# EasyEDA schematic CruiseControlSystemElectricalSchematic_11_28_19_EasyEDA.json

## Sheets
1 Sheet_1: TITLE: Cruise Control System Wiring Diagram; REV: 1.0; Date: 2019-10-14; Sheet: 1/1; Drawn By: tzmetz; Company: Mechmotum Lab
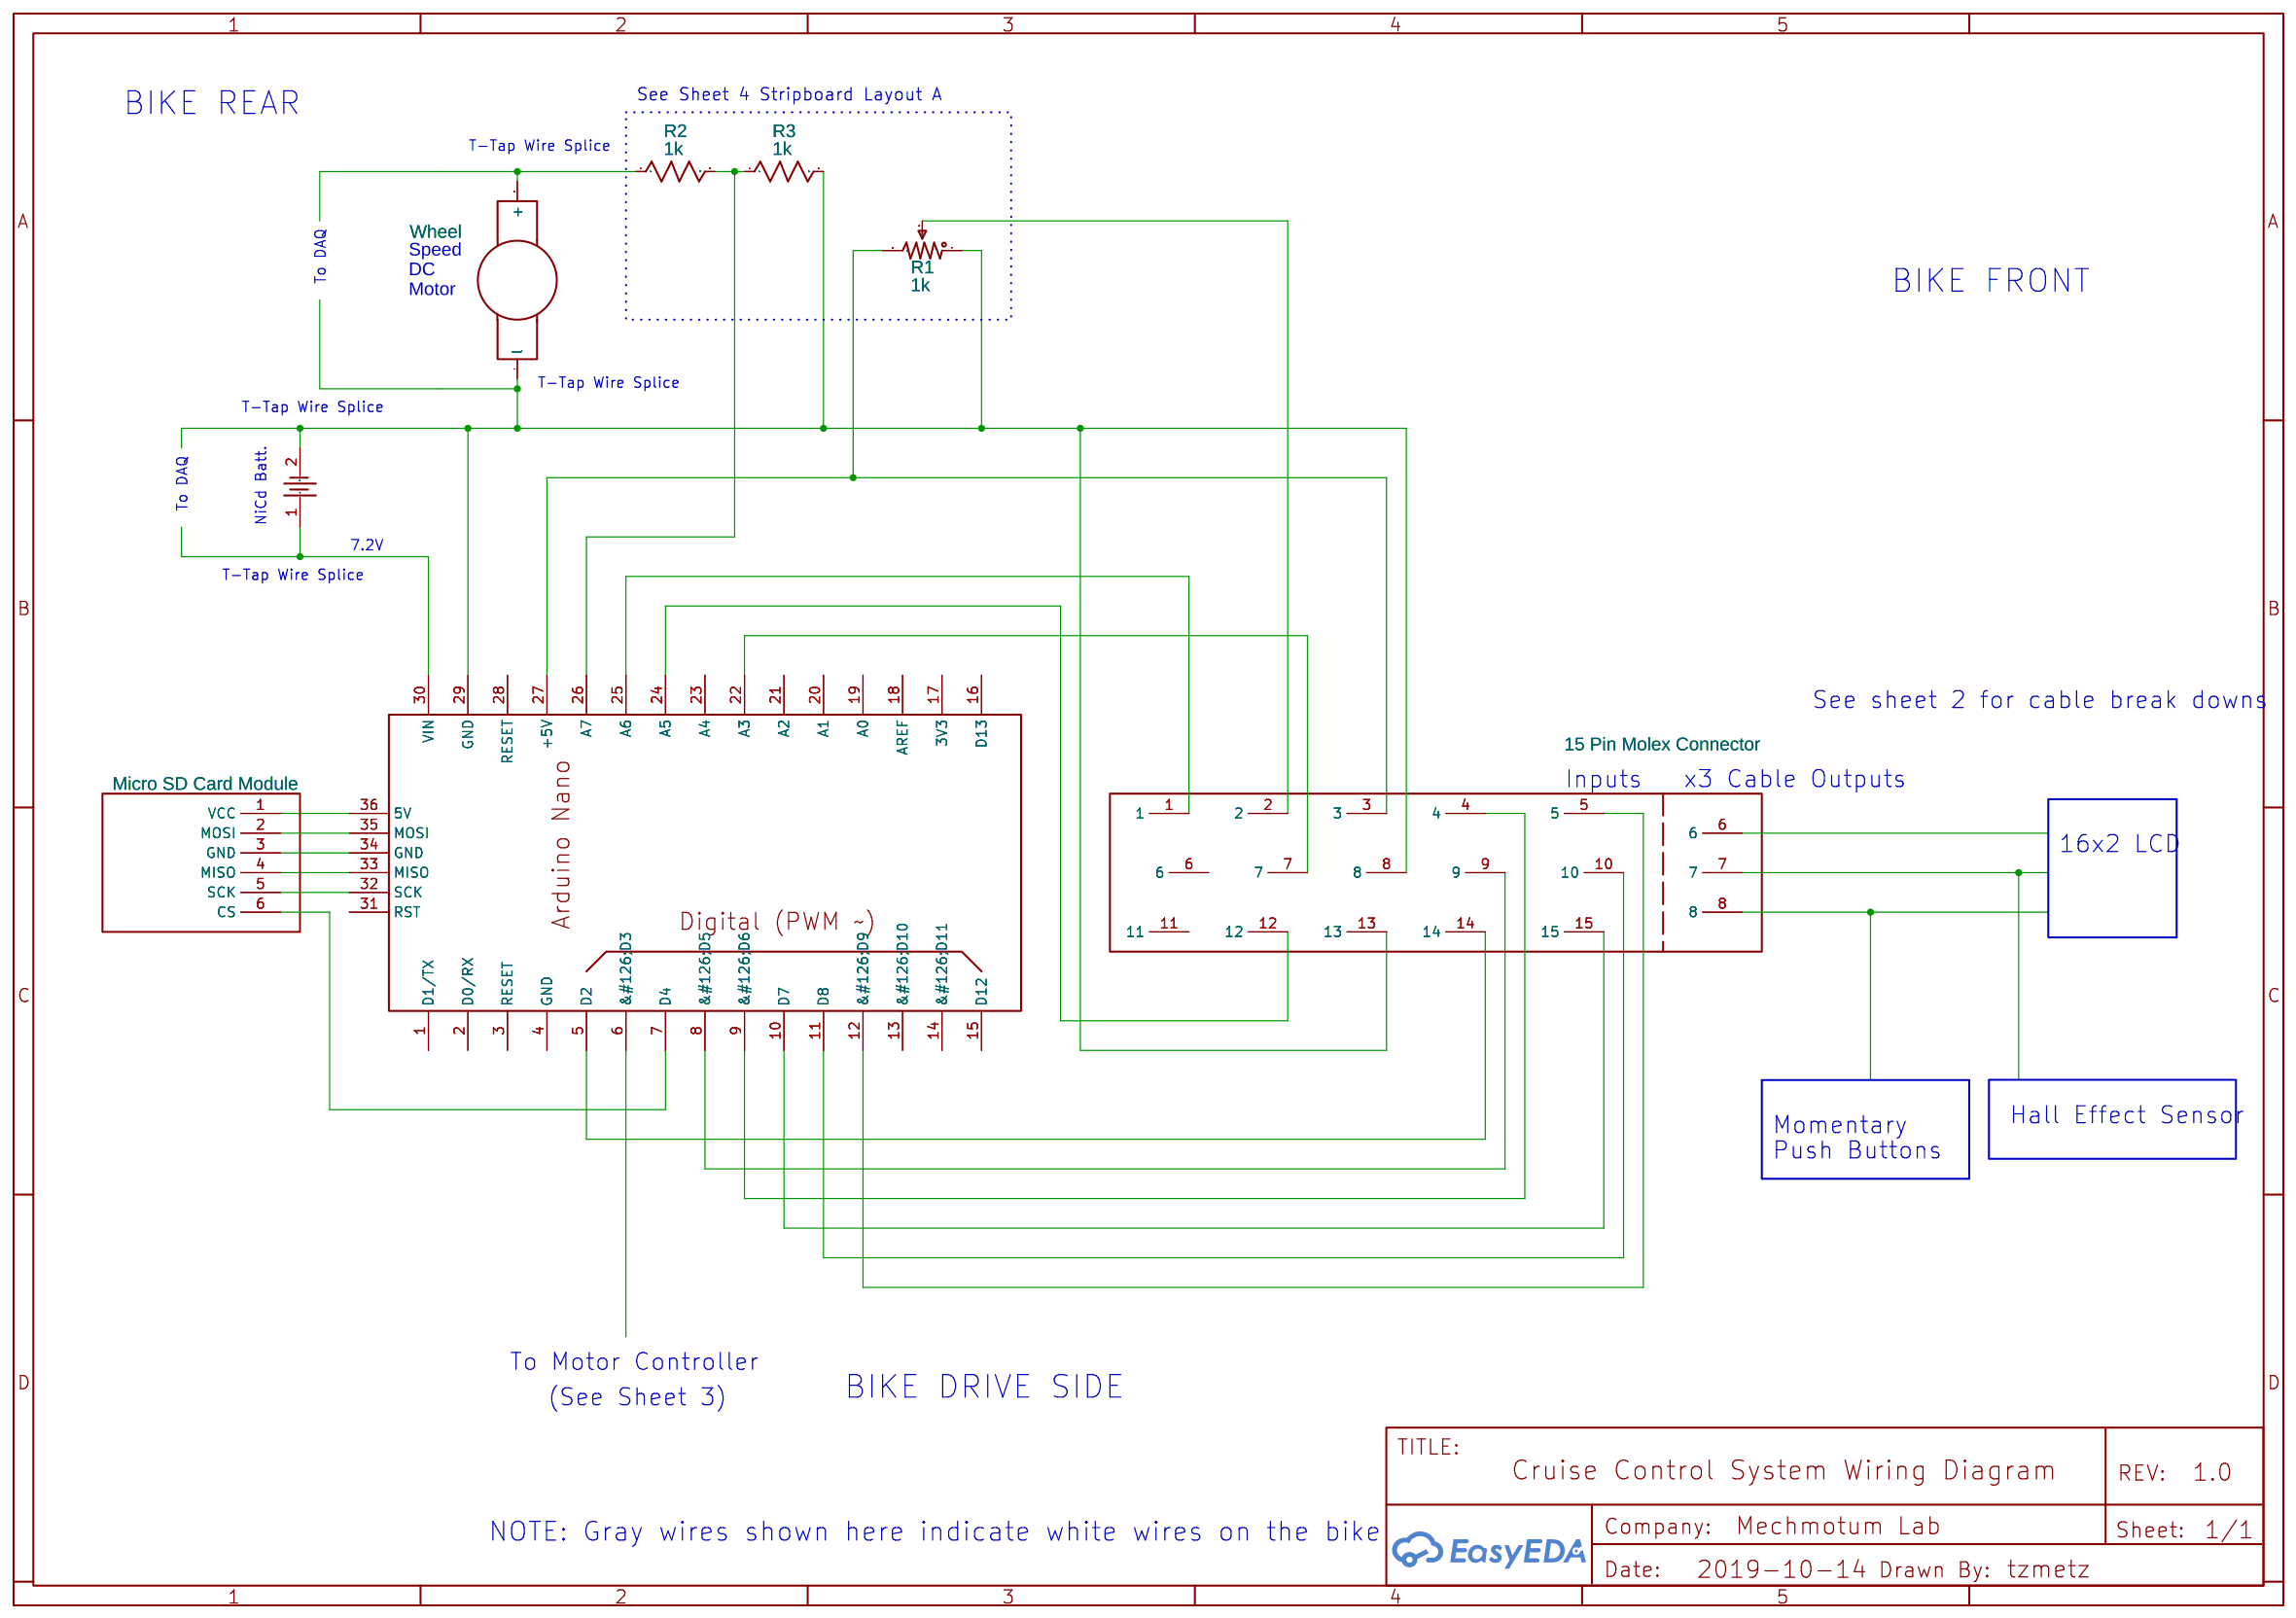
[diagram p0: Sheet_1]
2 Sheet_2: TITLE: Molex Connector Output Details; Date: 2019-10-16
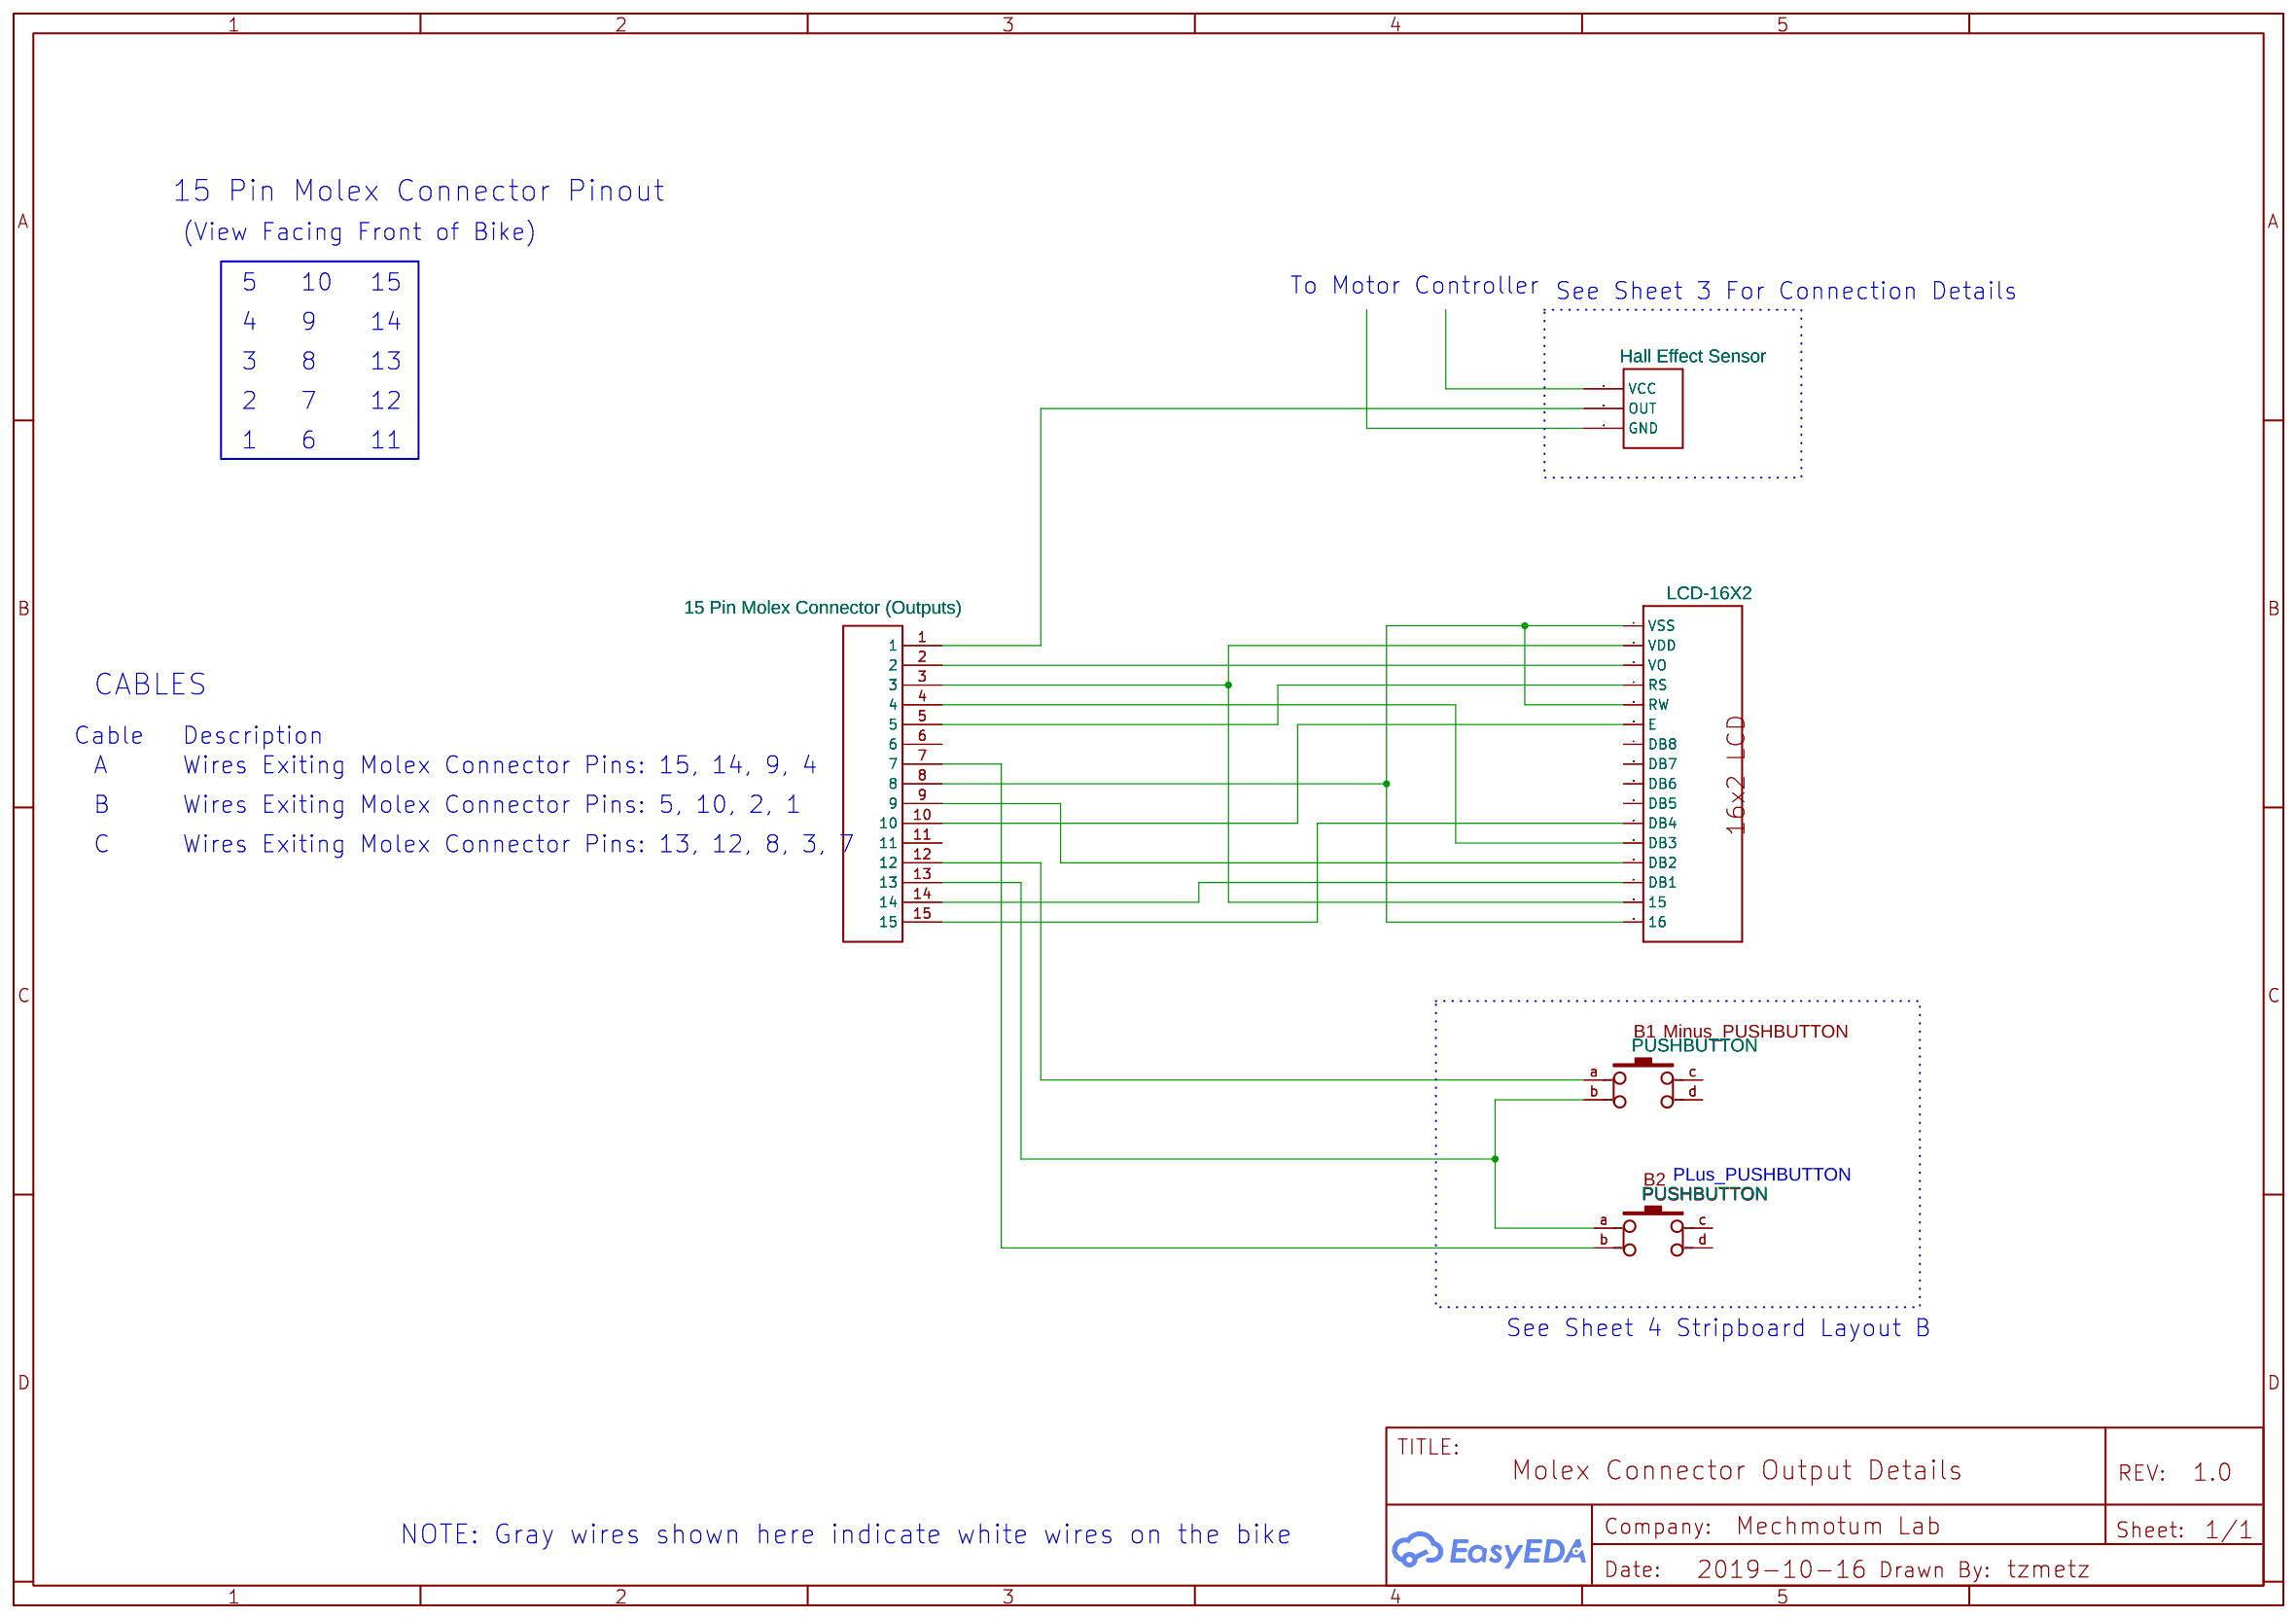
[diagram p1: Sheet_2]
3 Sheet_3: TITLE: Throttle Connection Diagram; Date: 2019-10-25
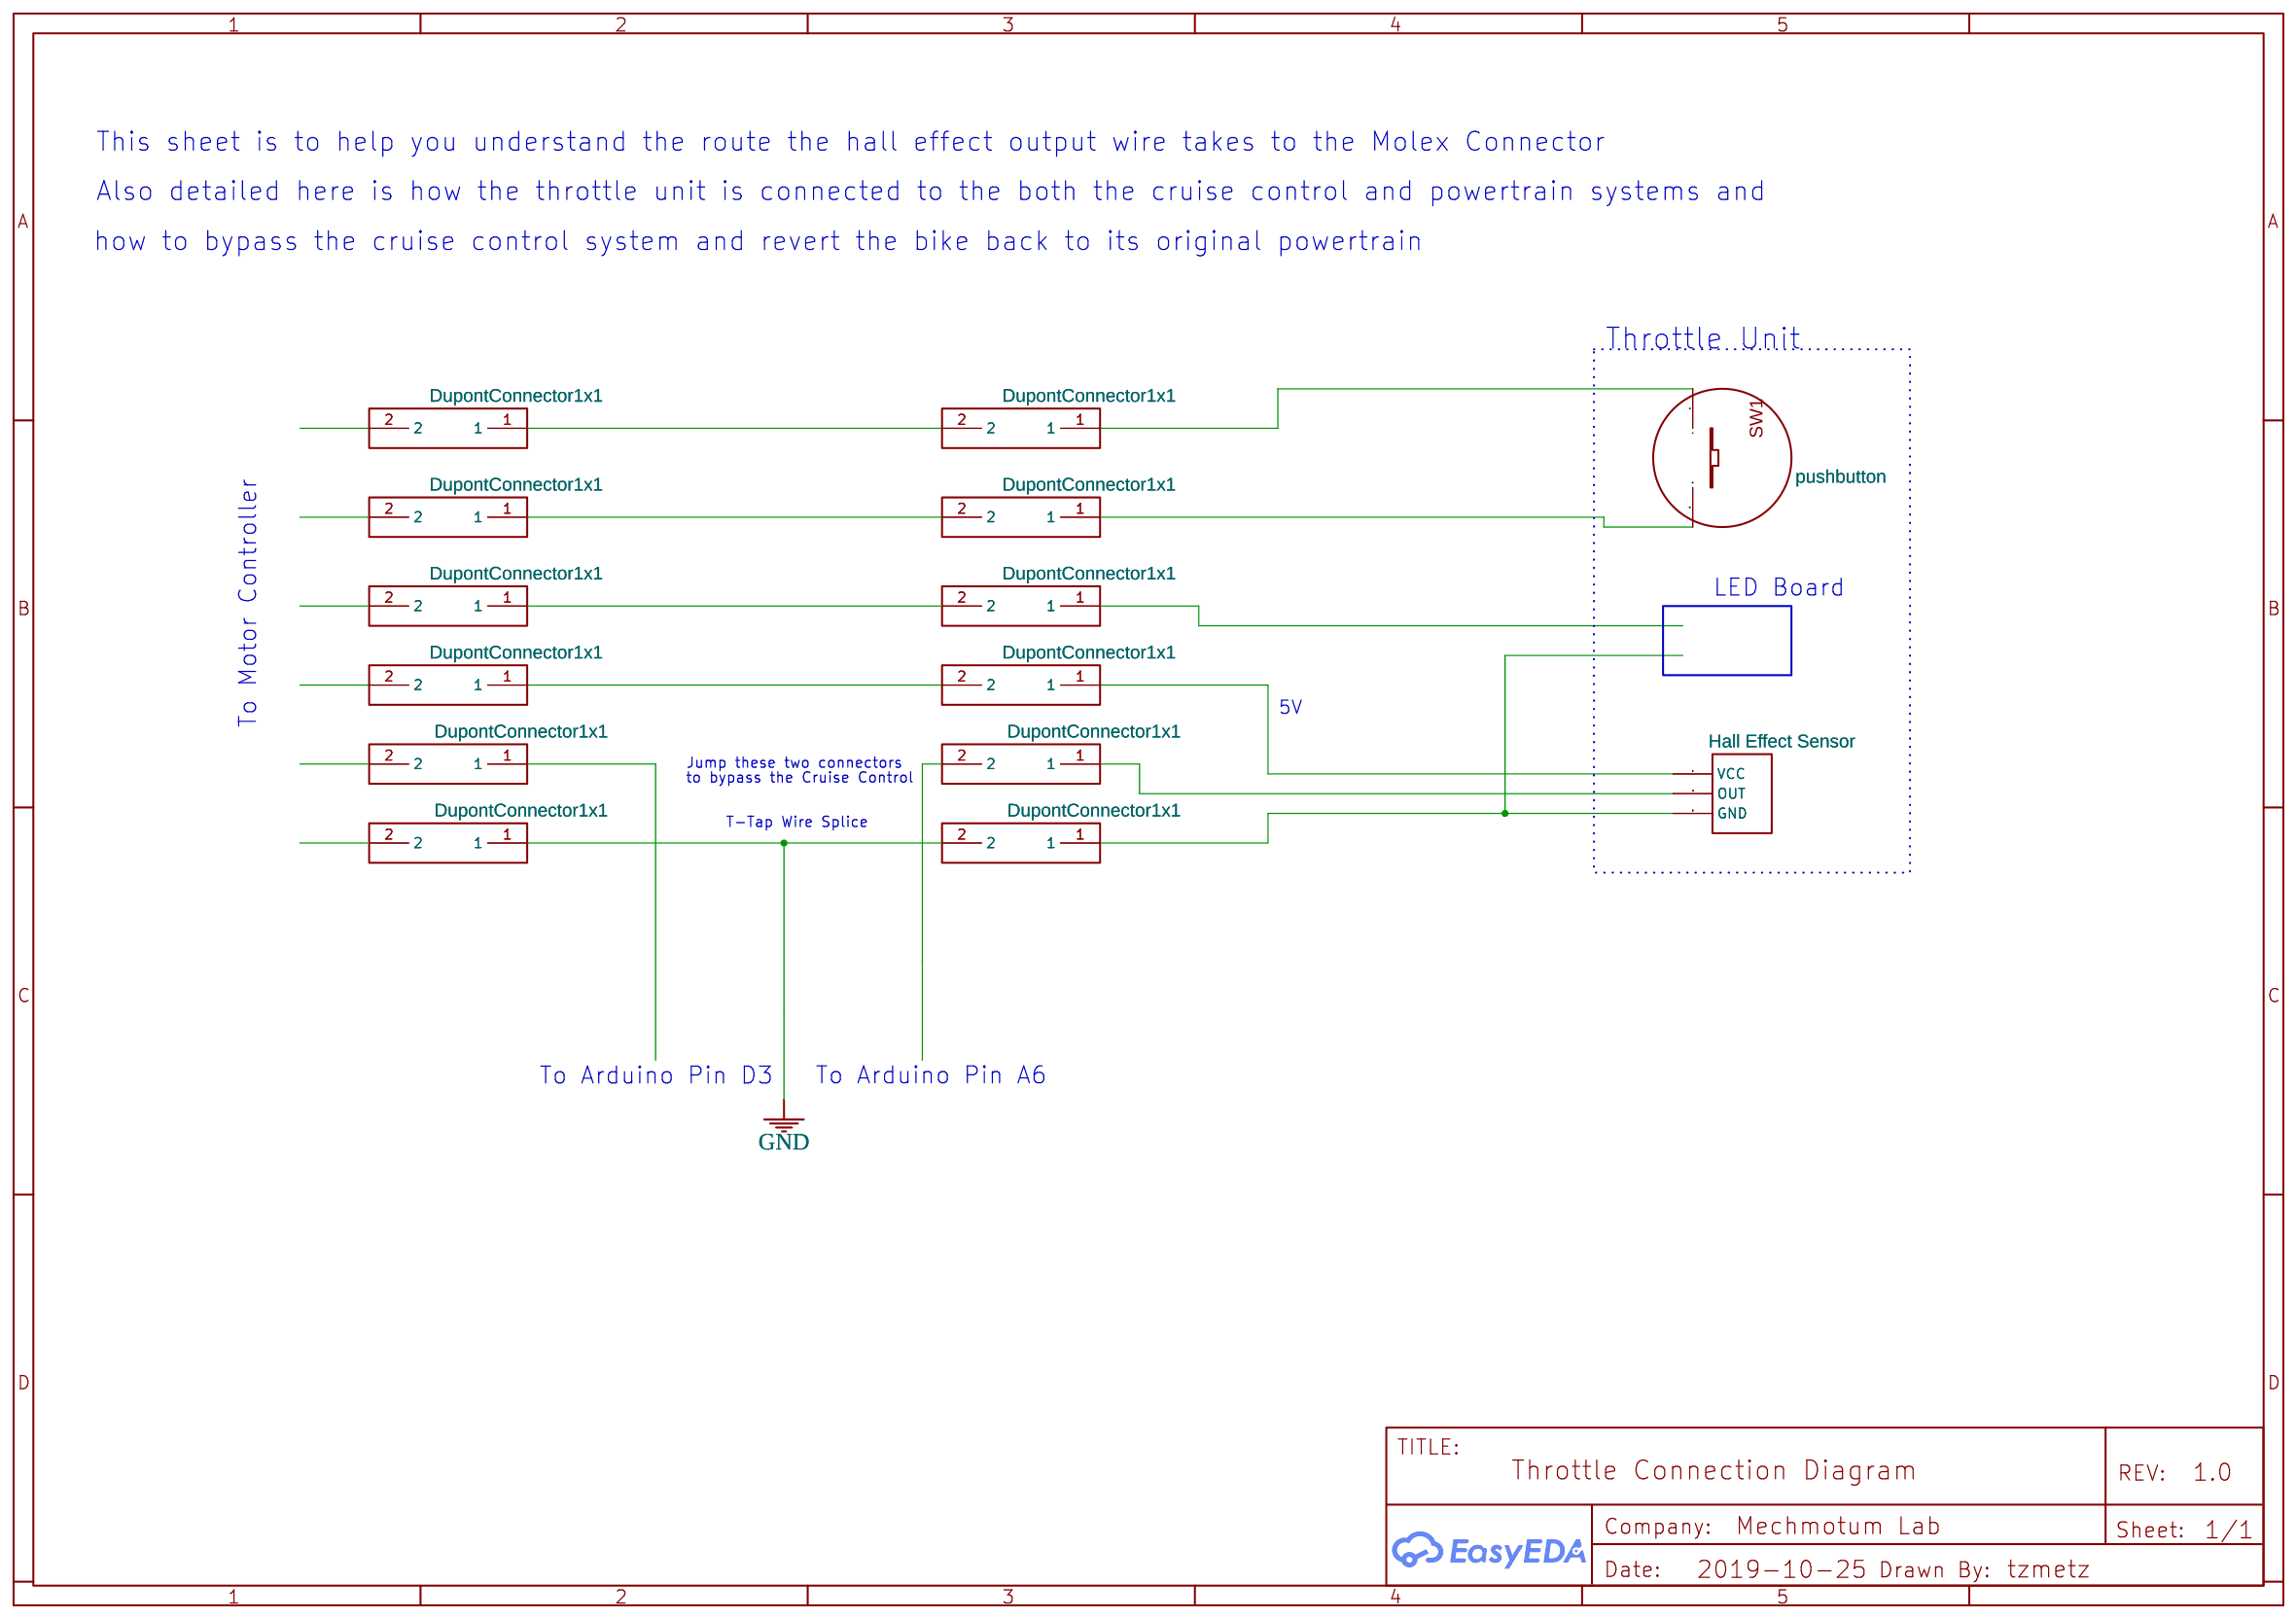
[diagram p2: Sheet_3]
4 Sheet_4: TITLE: Stripboard Layouts; Date: 2019-10-28
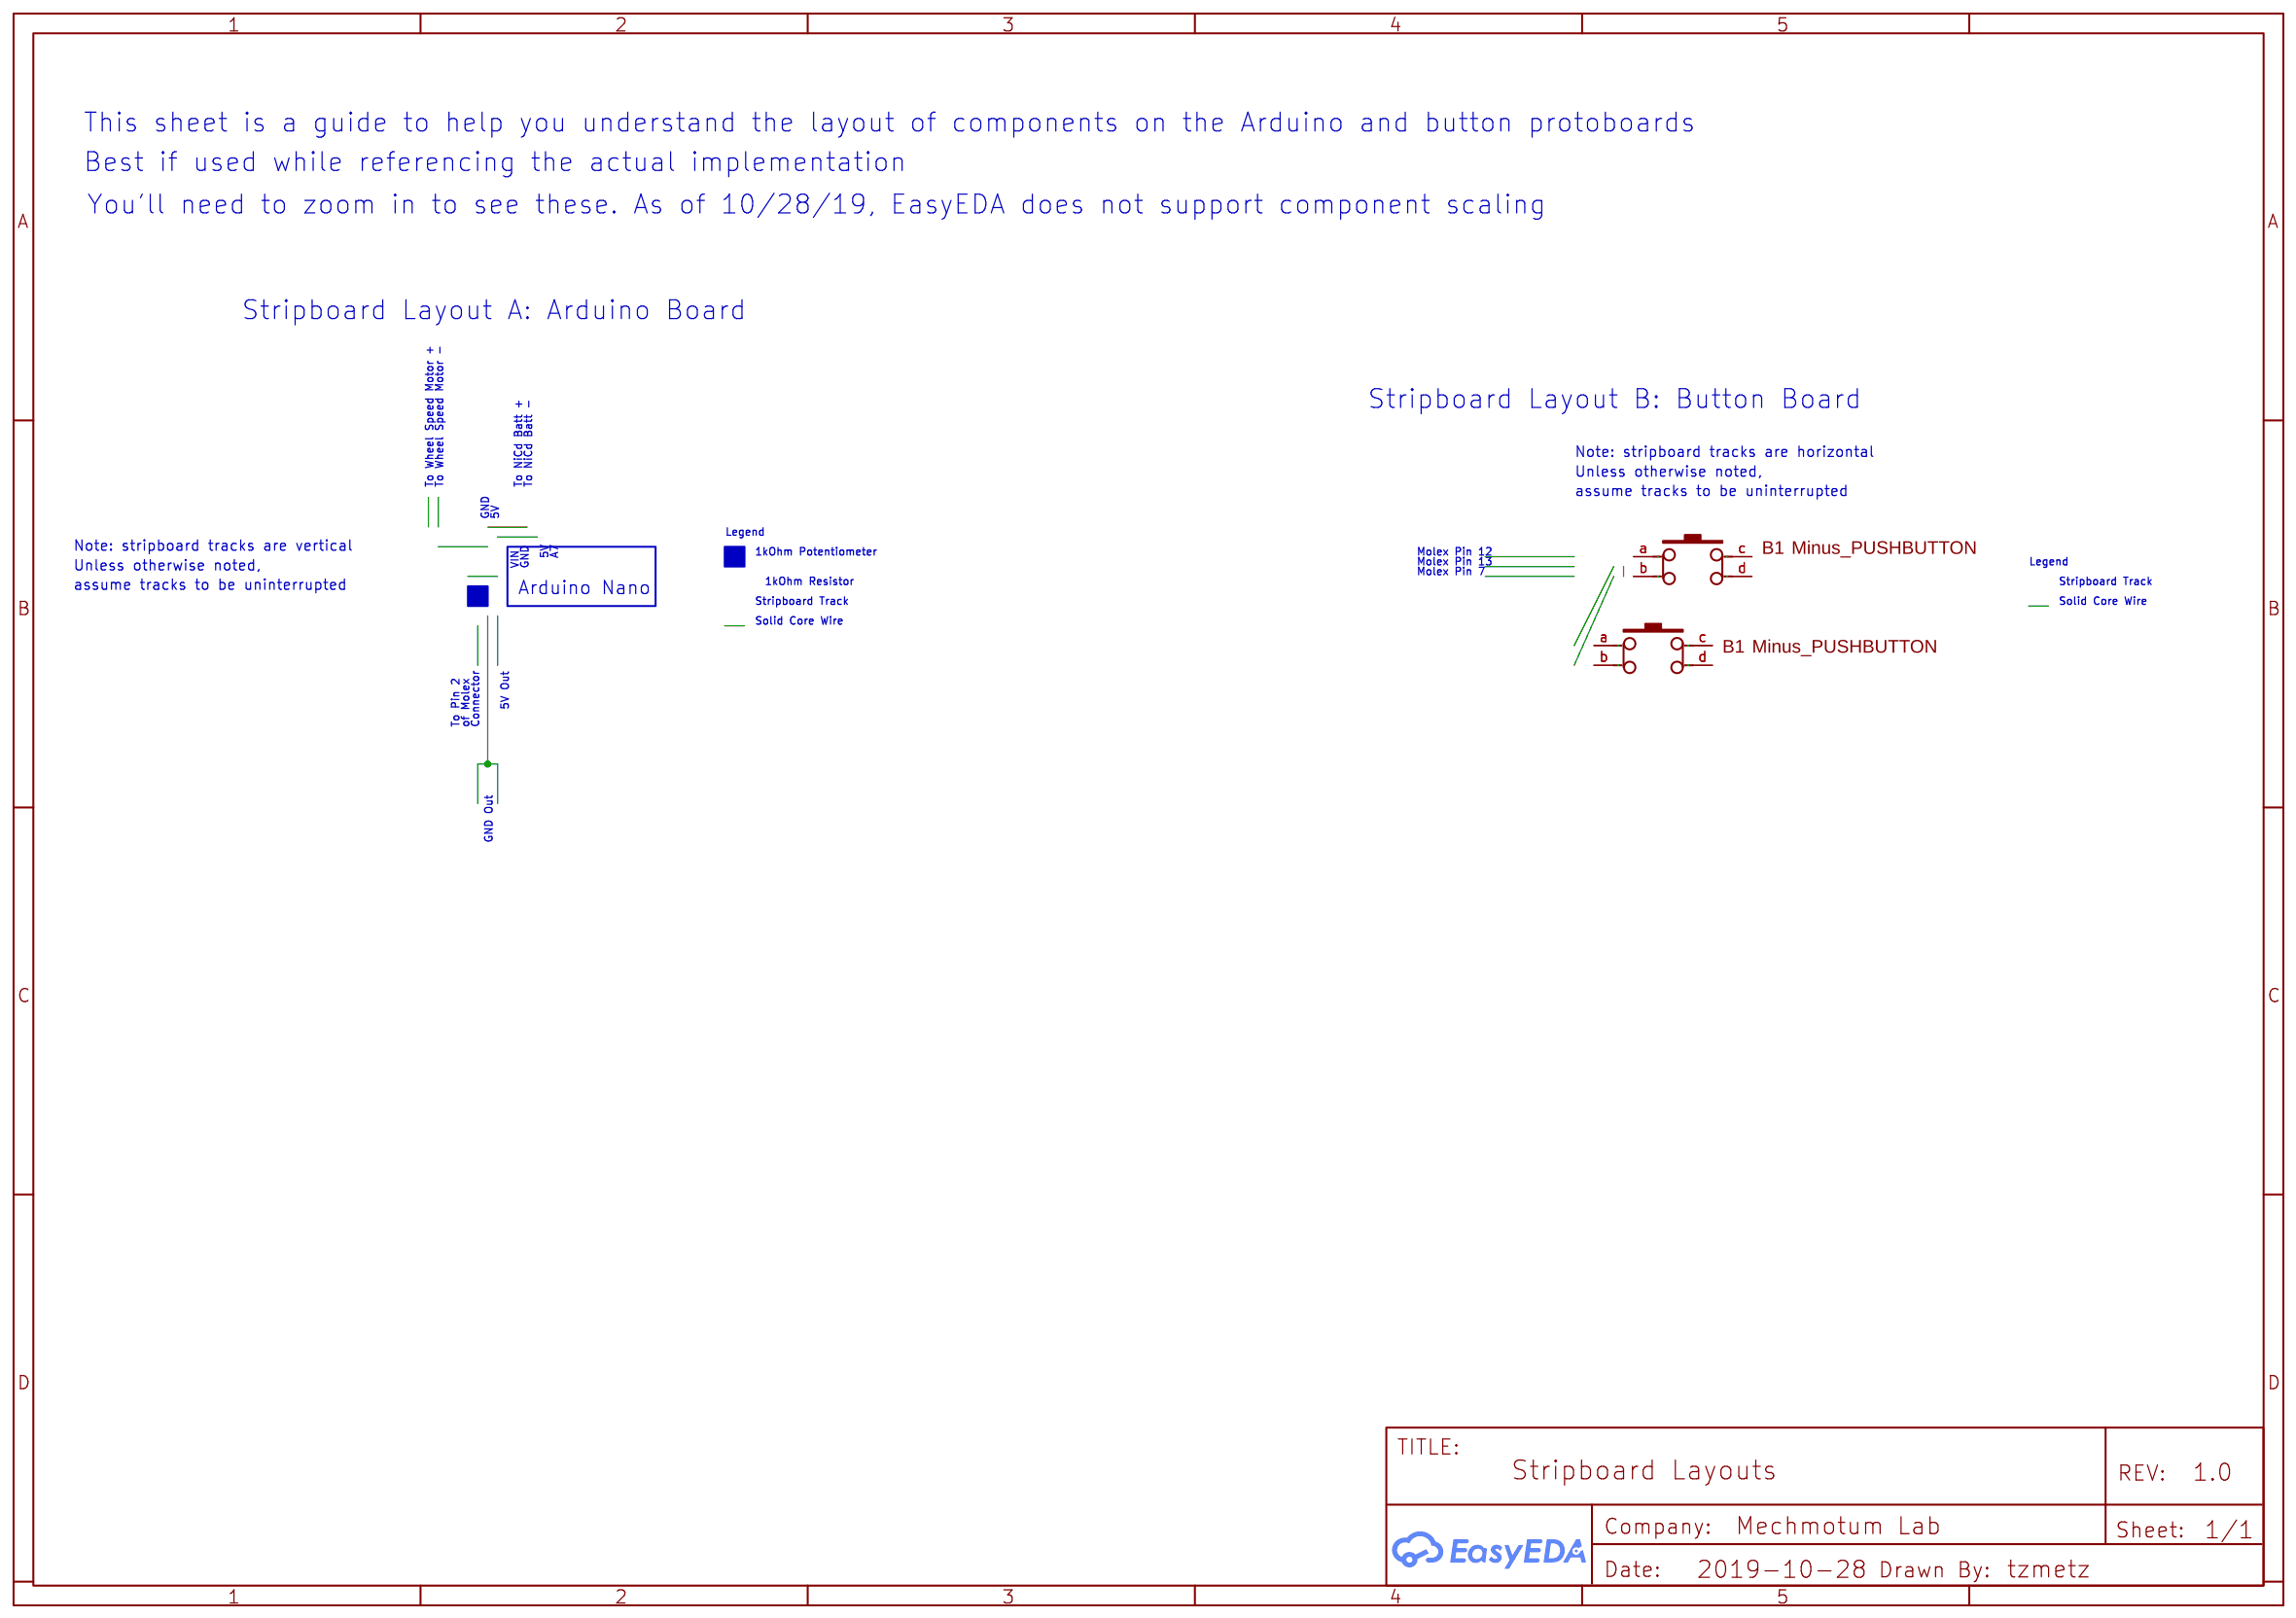
[diagram p3: Sheet_4]
5 Sheet_5: TITLE: Dead Man's Switch Wiring Schematic; Date: 2019-11-04
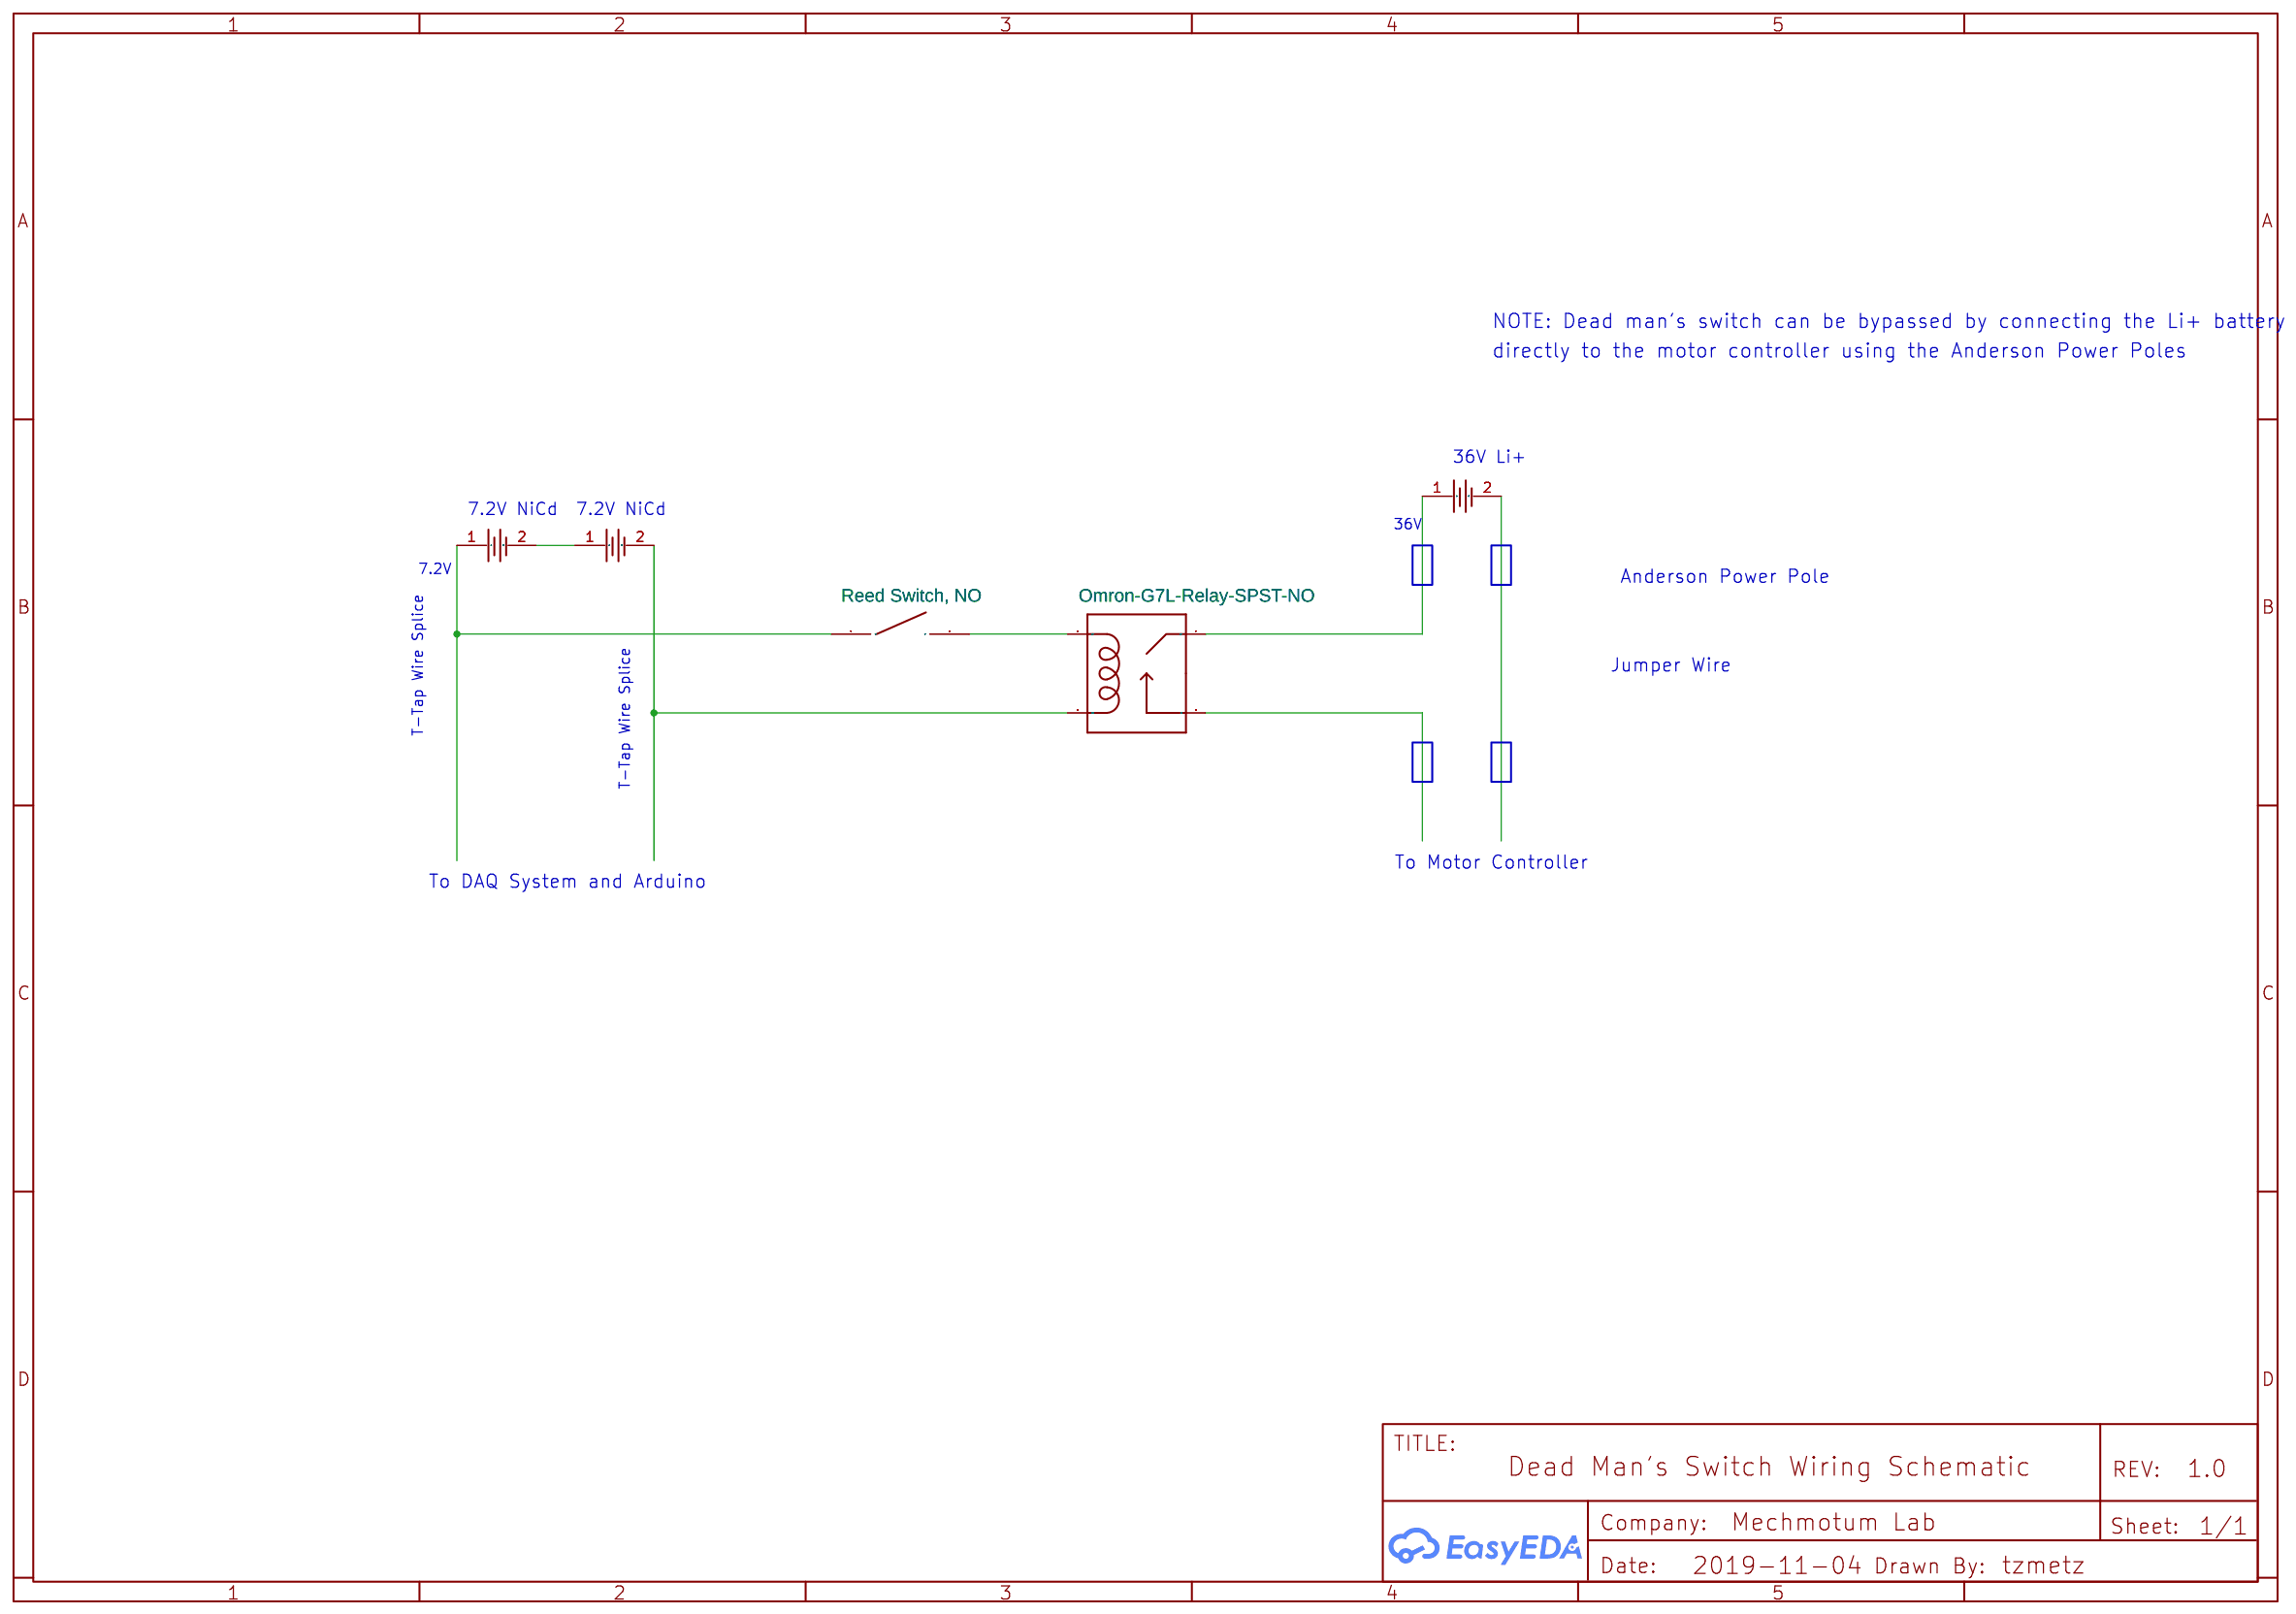
[diagram p4: Sheet_5]

## Parts
sheet Sheet_1
B1  NiCd Battery 7.2V Line  [BAT-TH_BS-2-1]
R1  1k  [RES-ADJ_3386P]
R2  1k  [AXIAL-0.3]
R3  1k  [AXIAL-0.3]
U2  ARDUINO_NANO COPY  [ARDUINO_NANO]
U5  Wheel  [DIP]
U8  Micro SD Card Module
U10  15 Pin Molex Connector
sheet Sheet_2
U1  PUSHBUTTON  [PUSHBUTTON]
U6  15 Pin Molex Connector (Outputs)
U11  LCD-16X2  [LCD-16X2_NOHOLES]
U12  PUSHBUTTON  [PUSHBUTTON]
U13  Hall Effect Sensor
sheet Sheet_3
U3  pushbutton
U4  Hall Effect Sensor
U7  DupontConnector1x1
U9  DupontConnector1x1
U14  DupontConnector1x1
U15  DupontConnector1x1
U16  DupontConnector1x1
U17  DupontConnector1x1
U18  DupontConnector1x1
U19  DupontConnector1x1
U20  DupontConnector1x1
U21  DupontConnector1x1
U22  DupontConnector1x1
U23  DupontConnector1x1
sheet Sheet_4
U24  PUSHBUTTON  [PUSHBUTTON]
U25  PUSHBUTTON  [PUSHBUTTON]
sheet Sheet_5
B2  BS-2-1  [BAT-TH_BS-2-1]
B3  BS-2-1  [BAT-TH_BS-2-1]
B4  BS-2-1  [BAT-TH_BS-2-1]
RL1  Omron-G7L-Relay-SPST-NO  [OMRON_G5LE_SPST_RELAY]
SW1  Reed Switch, NO  [KEY-6.0*6.0-4]

## Library data of the parts
B1 = -: Supplier: LCSC; Manufacturer: Q&J; Manufacturer Part: BS-2-1; image: //image.lceda.cn/szlcsc/C70376.jpg; Supplier Part: C70376
R1 = 3386P-1-101LF_US: Supplier: LCSC; Manufacturer: Bochen; Manufacturer Part: 3386P-1-101LF; Contributor: EasyEDA; Supplier Part: C125022
R2 R3 = Res_AXIAL-0.3(1/8W)_US
U2 = -: Manufacturer Part: ARDUINO_NANO_LIVETHINGS; Contributor: Vinícius Nicassio Ferreira; Supplier Part: ARDUINO_NANO_LIVETHINGS; link: HTTP://WWW.LIVETHINGS.COM.BR
U5 = -: Contributor: deadmanhide; sourceId: dYWQKEa7R
U7-U9 U14-U23 = -: Contributor: Trevor Metz
U10 = -: Contributor: tzmetz
U1 U12 U24 U25 = -: Contributor: Kithu24
U6 = -: Contributor: Federico; sourceId: lLFzQK2kC
U11 = -: Standard text-only 16x2 parallel input LCD; Contributor: SparkFun
U4 U13 = -: Contributor: grzdaczek2727
U3 = -: Manufacturer Part: push button; Contributor: Trevor Wilson
B2-B4 = -: Supplier: LCSC; Manufacturer: Q&J; image: //image.lceda.cn/szlcsc/C70376.jpg; Supplier Part: C70376
SW1 = -: Supplier: LCSC; Manufacturer: PANASONIC; Manufacturer Part: EVQ22705R; Contributor: LCSC; Supplier Part: C79156

## Nets
GND: U9.2 U22.1
Net-(B1-1): B1.1 U2.30(VIN)
Net-(B1-2): B1.2 R1.1 R3.2 U2.29(GND) U5.-(l) U10.8 U10.13
Net-(B2-1): B2.1 SW1.1
Net-(B2-2): B2.2 B3.1
Net-(B3-2): B3.2 RL1.5(COIL1)
Net-(B4-1): B4.1 RL1.1(MAIN)
Net-(R1-2): R1.2 U10.2
Net-(R1-3): R1.3 U2.27(+5V) U10.3
Net-(R2-1): R2.1 U5.1(+)
Net-(R2-2): R2.2 R3.1 U2.26(A7)
Net-(RL1-2): RL1.2(COIL2) SW1.2
Net-(U1-a): U1.a(1) U6.13 U12.b(1)
Net-(U1-b): U1.b(1) U6.7
Net-(U2-5): U2.5(D2) U10.14
Net-(U2-7): U2.7(D4) U8.6(CS)
Net-(U2-8): U2.8(&#126;D5) U10.9
Net-(U2-9): U2.9(&#126;D6) U10.4
Net-(U2-10): U2.10(D7) U10.15
Net-(U2-11): U2.11(D8) U10.10
Net-(U2-12): U2.12(&#126;D9) U10.5
Net-(U2-22): U2.22(A3) U10.7
Net-(U2-24): U2.24(A5) U10.12
Net-(U2-25): U2.25(A6) U10.1
Net-(U2-32): U2.32(SCK) U8.5(SCK)
Net-(U2-33): U2.33(MISO) U8.4(MISO)
Net-(U2-34): U2.34(GND) U8.3(GND)
Net-(U2-35): U2.35(MOSI) U8.2(MOSI)
Net-(U2-36): U2.36(5V) U8.1(VCC)
Net-(U3-1): U3.1 U17.1
Net-(U3-2): U3.2 U16.1
Net-(U4-1): U4.1(VCC) U15.1
Net-(U4-2): U4.2(OUT) U7.1
Net-(U4-3): U4.3(GND) U9.1
Net-(U6-1): U6.1 U13.2(OUT)
Net-(U6-2): U6.2 U11.3(VO)
Net-(U6-3): U6.3 U11.2(VDD) U11.15
Net-(U6-4): U6.4 U11.12(DB3)
Net-(U6-5): U6.5 U11.4(RS)
Net-(U6-8): U6.8 U11.1(VSS) U11.5(RW) U11.16
Net-(U6-9): U6.9 U11.13(DB2)
Net-(U6-10): U6.10 U11.6(E)
Net-(U6-12): U6.12 U12.a(1)
Net-(U6-14): U6.14 U11.14(DB1)
Net-(U6-15): U6.15 U11.11(DB4)
Net-(U14-2): U14.2 U21.1
Net-(U15-2): U15.2 U20.1
Net-(U16-2): U16.2 U19.1
Net-(U17-2): U17.2 U18.1

Not connected (* = marked no-connect by the designer): B4 2; RL1 3(NO); U1 c(3) d(2); U2 1(D1/TX) 2(D0/RX) 3(RESET) 4(GND) 6(&#126;D3) 13(&#126;D10) 14(&#126;D11) 15(D12) 16(D13) 17(3V3) 18(AREF) 19(A0) 20(A1) 21(A2) 23(A4) 28(RESET) 31(RST); U6 6 11; U7 2; U10 6 11; U11 7(DB8) 8(DB7) 9(DB6) 10(DB5); U12 c(3) d(2); U13 1(VCC) 3(GND); U14 1; U18 2; U19 2; U20 2; U21 2; U22 2; U23 1 2; U24 a(1) b(1) c(3) d(2); U25 a(1) b(1) c(3) d(2)

## Notes on the sheets
sheet 1
- BIKE REAR
- See Sheet 4 Stripboard Layout A
- T-Tap Wire Splice
- Speed
- DC
- BIKE FRONT
- To DAQ
- Motor
- T-Tap Wire Splice
- T-Tap Wire Splice
- To DAQ
- NiCd Batt.
- 7.2V
- T-Tap Wire Splice
- See sheet 2 for cable break downs
- Inputs
- x3 Cable Outputs
- 16x2 LCD
- Momentary
- Hall Effect Sensor
- Push Buttons
- To Motor Controller
- BIKE DRIVE SIDE
- (See Sheet 3)
- NOTE: Gray wires shown here indicate white wires on the bike
sheet 2
- 15 Pin Molex Connector Pinout
- (View Facing Front of Bike)
- 5
- 10
- 15
- To Motor Controller
- See Sheet 3 For Connection Details
- 4
- 9
- 14
- 3
- 8
- 13
- 2
- 7
- 12
- 1
- 6
- 11
- CABLES
- Cable
- Description
- A
- Wires Exiting Molex Connector Pins: 15, 14, 9, 4
- B
- Wires Exiting Molex Connector Pins: 5, 10, 2, 1
- C
- Wires Exiting Molex Connector Pins: 13, 12, 8, 3, 7
- PLus_PUSHBUTTON
- See Sheet 4 Stripboard Layout B
- NOTE: Gray wires shown here indicate white wires on the bike
sheet 3
- This sheet is to help you understand the route the hall effect output wire takes to the Molex Connector
- Also detailed here is how the throttle unit is connected to the both the cruise control and powertrain systems and
- how to bypass the cruise control system and revert the bike back to its original powertrain
- Throttle Unit
- LED Board
- 5V
- To Motor Controller
- Jump these two connectors
- to bypass the Cruise Control
- T-Tap Wire Splice
- To Arduino Pin D3
- To Arduino Pin A6
sheet 4
- This sheet is a guide to help you understand the layout of components on the Arduino and button protoboards
- Best if used while referencing the actual implementation
- You'll need to zoom in to see these. As of 10/28/19, EasyEDA does not support component scaling
- Stripboard Layout A: Arduino Board
- Stripboard Layout B: Button Board
- Note: stripboard tracks are horizontal
- Unless otherwise noted,
- To Wheel Speed Motor +
- To Wheel Speed Motor -
- To NiCd Batt +
- To NiCd Batt -
- assume tracks to be uninterrupted
- GND
- 5V
- Legend
- Note: stripboard tracks are vertical
- Unless otherwise noted,
- 5V
- A7
- 1kOhm Potentiometer
- Molex Pin 12
- Molex Pin 13
- Legend
- assume tracks to be uninterrupted
- VIN
- Arduino Nano
- GND
- 1kOhm Resistor
- Molex Pin 7
- Stripboard Track
- Stripboard Track
- Solid Core Wire
- Solid Core Wire
- 5V Out
- To Pin 2
- of Molex
- Connector
- GND Out
sheet 5
- NOTE: Dead man's switch can be bypassed by connecting the Li+ battery
- directly to the motor controller using the Anderson Power Poles
- 36V Li+
- 7.2V NiCd
- 7.2V NiCd
- 36V
- 7.2V
- Anderson Power Pole
- Jumper Wire
- T-Tap Wire Splice
- T-Tap Wire Splice
- To Motor Controller
- To DAQ System and Arduino
